# Altium schematic sheet boost.SchDoc
size A4
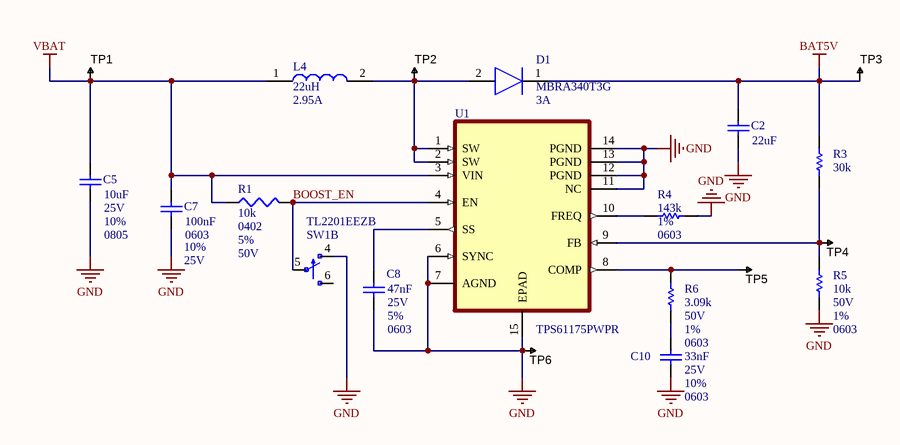
[diagram p0: boost.SchDoc]

## Parts
C2  value 22uF  [C0805]  (hidden comment: Cap Semi)
C5  value 10uF  Case/Package: 0805  Tolerance: 10%  Voltage Rating (DC): 25V  [C0805]  (hidden comment: Cap Semi)
C7  value 100nF  Case/Package: 0603  Tolerance: 10%  Voltage: 25V  [C0603]  (hidden comment: Cap Semi)
C8  value 47nF  Case/Package: 0603  Tolerance: 5%  Voltage Rating: 25V  [C0603]  (hidden comment: Cap Semi)
C10  value 33nF  Case/Package: 0603  Tolerance: 10%  Voltage Rating (DC): 25V  [C0603]  (hidden comment: Cap Semi)
D1  MBRA340T3G  Forward Current: 3A  [MBRA340T3G]
L4  value 22uH  Saturation Current: 2.95A  [CDRH105RNP-220NC]
R1  value 10k  Case/Package: 0402  Tolerance: 5%  Voltage Rating: 50V  [R0402]  (hidden comment: Res3)
R3  value 30k  [R0603]  (hidden comment: Res3)
R4  value 143k  Case/Package: 0603  Tolerance: 1%  [R0603]  (hidden comment: Res3)
R5  value 10k  Case/Package: 0603  Tolerance: 1%  Voltage Rating: 50V  [R0603]  (hidden comment: Res3)
R6  value 3.09k  Case/Package: 0603  Tolerance: 1%  Voltage Rating (DC): 50V  [R0603]  (hidden comment: Res3)
SW1  TL2201EEZB  [TL2201EEZB]  (part B of 2)
TP1  TESTPOINT  [TP-R60]  (value not drawn)  (no BOM)
TP2  TESTPOINT  [TP-R60]  (value not drawn)  (no BOM)
TP3  TESTPOINT  [TP-R60]  (value not drawn)  (no BOM)
TP4  TESTPOINT  [TP-R60]  (value not drawn)  (no BOM)
TP5  TESTPOINT  [TP-R60]  (value not drawn)  (no BOM)
TP6  TESTPOINT  [TP-R60]  (value not drawn)  (no BOM)
U1  TPS61175PWPR  [TPS61175PWPR]

## Nets
BAT5V: C2.2 D1.1(K) R3.1 TP3.1
GND: C2.1 C5.1 C7.1 C8.1 C10.1 R4.1 R5.2 SW1.4(O) TP6.1 U1.6(SYNC) U1.7(AGND) U1.11(NC) U1.12(PGND) U1.13(PGND) U1.14(PGND) U1.15(EPAD)
VBAT: C5.2 C7.2 L4.1 R1.1 TP1.1 U1.3(VIN)
BOOST_EN: R1.2 SW1.5(P) U1.4(EN)
NetC8_2: C8.2 U1.5(SS)
NetC10_2: C10.2 R6.2
NetD1_2: D1.2(A) L4.2 TP2.1 U1.1(SW) U1.2(SW)
NetR3_2: R3.2 R5.1 TP4.1 U1.9(FB)
NetR4_2: R4.2 U1.10(FREQ)
NetR6_1: R6.1 TP5.1 U1.8(COMP)

Not connected (* = marked no-connect by the designer): SW1 6(S)

## Library data of the parts
C2 = Cap Semi_1: Capacitor
C5 = Cap Semi_1: Capacitor; Manufacturer: Murata; Manufacturer Part Number: GRM21BR61E106KA73K; Dielectric: X5R; Supplier 1: Digi-Key; Supplier Part Number 1: 490-16824-1-ND; Stock 1: 55460; Pricing 1: 1=0.25, 10=0.172, 50=0.1034, 100=0.0874, 500=0.0598, 1000=0.0529, 2500=0.0506, 5000=0.046 (USD); Mount: Surface Mount; Weight: 0.000335oz; Min Operating Temperature: -55°C; Max Operating Temperature: 85°C; Packaging: Tape and Reel; Voltage Rating: 25V; Package Quantity: 10000; Length: 0.079inch; Width: 0.049inch; Thickness: 0.055inch; ComponentLink1URL: http://www.mouser.com/ds/2/281/c02e-2905.pdf?src-supplier=Mouser; ComponentLink1Description: http://www.mouser.com/ds/2/281/c02e-2905.pdf?src-supplier=Mouser; ComponentLink2URL: http://search.murata.co.jp/Ceramy/image/img/A01X/G101/ENG/GRM21BR61E106KA73-01.pdf?src-supplier=Digi-Key; ComponentLink2Description: http://search.murata.co.jp/Ceramy/image/img/A01X/G101/ENG/GRM21BR61E106KA73-01.pdf?src-supplier=Digi-Key; ComponentLink3URL: https://search.murata.co.jp/Ceramy/image/img/A01X/G101/ENG/GRM21BR61E106KA73-01.pdf?src-supplier=Digi-Key; ComponentLink3Description: https://search.murata.co.jp/Ceramy/image/img/A01X/G101/ENG/GRM21BR61E106KA73-01.pdf?src-supplier=Digi-Key
C7 = Cap Semi_1: Capacitor; Manufacturer: Yageo; Manufacturer Part Number: CC0603KRX7R8BB104; Dielectric: X7R; Supplier 1: Digi-Key; Supplier Part Number 1: 311-1341-1-ND; Stock 1: 11551656; Pricing 1: 1=0.1, 10=0.05, 50=0.0274, 100=0.0224, 500=0.016, 1000=0.0126 (USD); Mount: Surface Mount; Number of Pins: 2; Case Code (Imperial): 0603; Case Code (Metric): 1608; Min Operating Temperature: -55°C; Max Operating Temperature: 125°C; Voltage Rating: 25V; Packaging: Tape and Reel; Package Quantity: 1; Voltage Rating (DC): 25V; Termination: SMD/SMT; Composition: Ceramic; Length: 1.6mm; Height: 0.8mm; Width: 0.8mm; Thickness: 0.035inch; Depth: 0.8mm; Radiation Hardening: No; REACH SVHC: Unknown; Lead Free: Lead Free; Halogen Free: Halogen Free; ComponentLink1URL: http://www.yageo.com/documents/recent/UPY-GPHC_X7R_6.3V-to-50V_8.pdf?src-supplier=Avnet+Europe; ComponentLink1Description: http://www.yageo.com/documents/recent/UPY-GPHC_X7R_6.3V-to-50V_8.pdf?src-supplier=Avnet+Europe; ComponentLink2URL: https://www.verical.com/server-webapp/html/getDatasheet?partID=403577&src-supplier=Verical; ComponentLink2Description: https://www.verical.com/server-webapp/html/getDatasheet?partID=403577&src-supplier=Verical; ComponentLink3URL: http://www.yageo.com/documents/recent/UPY-GPHC_X7R_6.3V-to-50V_8.pdf?src-supplier=Avnet; ComponentLink3Description: http://www.yageo.com/documents/recent/UPY-GPHC_X7R_6.3V-to-50V_8.pdf?src-supplier=Avnet; ComponentLink4URL: http://www.mouser.com/ds/2/447/Yageo_UPY-GP_NP0_16V-to-50V_9-358835.pdf?src-supplier=Mouser; ComponentLink4Description: http://www.mouser.com/ds/2/447/Yageo_UPY-GP_NP0_16V-to-50V_9-358835.pdf?src-supplier=Mouser; ComponentLink5URL: https://4donline.ihs.com/images/VipMasterIC/IC/YAGO/YAGO-S-A0003557223/YAGO-S-A0003557223-1.pdf?hkey=6D3A4C79FDBF58556ACFDE234799DDF0&src-supplier=Element14; ComponentLink5Description: https://4donline.ihs.com/images/VipMasterIC/IC/YAGO/YAGO-S-A0003557223/YAGO-S-A0003557223-1.pdf?hkey=6D3A4C79FDBF58556ACFDE234799DDF0&src-supplier=Element14; ComponentLink6URL: http://www.yageo.com/documents/recent/UPY-GPHC_X7R_6.3V-to-50V_18.pdf?src-supplier=Digi-Key; ComponentLink6Description: http://www.yageo.com/documents/recent/UPY-GPHC_X7R_6.3V-to-50V_18.pdf?src-supplier=Digi-Key; ComponentLink7URL: http://www.farnell.com/datasheets/1489800.pdf?src-supplier=Element14; ComponentLink7Description: http://www.farnell.com/datasheets/1489800.pdf?src-supplier=Element14
C8 = Cap Semi_1: Capacitor; Manufacturer: KEMET; Manufacturer Part Number: C0603C473J3RACTU; Dielectric Material: Ceramic; Dielectric: X7R; Dissipation Factor: 3.5%; Supplier 1: Digi-Key; Supplier Part Number 1: 399-7929-1-ND; Stock 1: 73434; Pricing 1: 1=0.14, 10=0.098, 50=0.056, 100=0.0463, 500=0.0325, 1000=0.0269 (USD); Mount: Surface Mount; Case Code (Imperial): 0603; Case Code (Metric): 1608; Min Operating Temperature: -55°C; Max Operating Temperature: 125°C; Package Quantity: 1; Packaging: Tape and Reel; Voltage Rating (DC): 25V; Termination: SMD/SMT; Length: 1.6mm; Height: 0.8mm; Width: 0.8mm; Lead Pitch: 0.7mm; Thickness: 0.034inch; Depth: 0.8mm; Radiation Hardening: No; REACH SVHC: No SVHC; ComponentLink1URL: http://www.mouser.com/ds/2/212/KEM_C1002_X7R_SMD-1102033.pdf?src-supplier=Mouser; ComponentLink1Description: http://www.mouser.com/ds/2/212/KEM_C1002_X7R_SMD-1102033.pdf?src-supplier=Mouser; ComponentLink2URL: http://capacitoredge.kemet.com/capedge2/DataSheet?pn=C0603C473J3RAC7867&src-supplier=Avnet; ComponentLink2Description: http://capacitoredge.kemet.com/capedge2/DataSheet?pn=C0603C473J3RAC7867&src-supplier=Avnet; ComponentLink3URL: http://www.farnell.com/datasheets/2745905.pdf?src-supplier=Newark; ComponentLink3Description: http://www.farnell.com/datasheets/2745905.pdf?src-supplier=Newark; ComponentLink4URL: https://api.kemet.com/component-edge/download/datasheet/C0603C473J3RACTU.pdf?src-supplier=Digi-Key; ComponentLink4Description: https://api.kemet.com/component-edge/download/datasheet/C0603C473J3RACTU.pdf?src-supplier=Digi-Key; ComponentLink5URL: http://www.farnell.com/datasheets/2745905.pdf?src-supplier=Farnell; ComponentLink5Description: http://www.farnell.com/datasheets/2745905.pdf?src-supplier=Farnell; ComponentLink6URL: http://www.farnell.com/datasheets/2112169.pdf?src-supplier=Element14; ComponentLink6Description: http://www.farnell.com/datasheets/2112169.pdf?src-supplier=Element14; ComponentLink7URL: https://search.kemet.com/component-edge/download/datasheet/C0603C473J3RACTU.pdf?src-supplier=Digi-Key; ComponentLink7Description: https://search.kemet.com/component-edge/download/datasheet/C0603C473J3RACTU.pdf?src-supplier=Digi-Key; ComponentLink8URL: http://components.arrow.com/part/dataview/2627846S4295859N7429?src-supplier=Arrow+Electronics; ComponentLink8Description: http://components.arrow.com/part/dataview/2627846S4295859N7429?src-supplier=Arrow+Electronics
C10 = Cap Semi_1: Capacitor; Manufacturer: KEMET; Manufacturer Part Number: C0603C333K3RACTU; Dielectric Material: Ceramic; Dielectric: X7R; Dissipation Factor: 3.5%; Supplier 1: Digi-Key; Supplier Part Number 1: 399-7904-1-ND; Stock 1: 315627; Pricing 1: 1=0.1, 10=0.067, 50=0.0364, 100=0.0296, 500=0.0212, 1000=0.0166 (USD); Mount: Surface Mount; Case Code (Metric): 1608; Case Code (Imperial): 0603; Min Operating Temperature: -55°C; Max Operating Temperature: 125°C; Package Quantity: 1; Voltage Rating: 25V; Packaging: Tape and Reel; Termination: SMD/SMT; Length: 1.6mm; Height: 0.8mm; Width: 0.031inch; Thickness: 0.034inch; Lead Pitch: 0.7mm; Depth: 0.8mm; Radiation Hardening: No; REACH SVHC: No SVHC; ComponentLink1URL: http://www.mouser.com/ds/2/212/KEM_C1002_X7R_SMD-1102033.pdf?src-supplier=Mouser; ComponentLink1Description: http://www.mouser.com/ds/2/212/KEM_C1002_X7R_SMD-1102033.pdf?src-supplier=Mouser; ComponentLink2URL: https://www.verical.com/server-webapp/html/getDatasheet?partID=72507&src-supplier=Verical; ComponentLink2Description: https://www.verical.com/server-webapp/html/getDatasheet?partID=72507&src-supplier=Verical; ComponentLink3URL: http://www.farnell.com/datasheets/2740666.pdf?src-supplier=Element14; ComponentLink3Description: http://www.farnell.com/datasheets/2740666.pdf?src-supplier=Element14; ComponentLink4URL: http://www.farnell.com/datasheets/1851736.pdf?src-supplier=Element14; ComponentLink4Description: http://www.farnell.com/datasheets/1851736.pdf?src-supplier=Element14; ComponentLink5URL: https://www.verical.com/server-webapp/html/getDatasheet?partID=385538&src-supplier=Verical; ComponentLink5Description: https://www.verical.com/server-webapp/html/getDatasheet?partID=385538&src-supplier=Verical
D1 = MBRA340T3G: Diode; Manufacturer_Name: ON Semiconductor; Forward Voltage: 450mV; Peak Reverse Current: 300uA; Max Repetitive Reverse Voltage (Vrrm): 40V; Max Forward Surge Current (Ifsm): 100A; Element Configuration: Single; Polarity: Standard; Datasheet Link: http://www.onsemi.com/pub/Collateral/MBRA340T3-D.PDF; Height: 2.2mm; Manufacturer_Part_Number: MBRA340T3G; Arrow Part Number: MBRA340T3G; Arrow Price/Stock: https://www.arrow.com/en/products/mbra340t3g/on-semiconductor; Mouser Part Number: 863-MBRA340T3G; Mouser Price/Stock: https://www.mouser.co.uk/ProductDetail/ON-Semiconductor/MBRA340T3G?qs=3JMERSakebq0pjb145uRLw%3D%3D; Supplier 1: Digi-Key; Supplier Part Number 1: MBRA340T3GOSCT-ND; Manufacturer: ON Semiconductor; Manufacturer Part Number: MBRA340T3G; Stock 1: 94537; Pricing 1: 1=0.46, 10=0.344, 100=0.24, 500=0.152, 1000=0.1184 (USD); Case/Package: SMA; Number of Pins: 2; Min Operating Temperature: -55°C; Max Operating Temperature: 150°C; Package Quantity: 1; Packaging: Tape and Reel; Average Rectified Current: 3A; Peak Non-Repetitive Surge Current: 100A; Max Reverse Voltage (DC): 40V; Voltage Rating (DC): 40V; Current Rating: 3A; Output Current: 3A; Length: 4.32mm; Width: 2.6mm; Radiation Hardening: No; Lead Free: Lead Free; Halogen Free: Halogen Free; REACH SVHC: No SVHC; ComponentLink1URL: http://www.farnell.com/datasheets/1750836.pdf?src-supplier=Farnell; ComponentLink1Description: http://www.farnell.com/datasheets/1750836.pdf?src-supplier=Farnell; ComponentLink2URL: http://www.onsemi.cn/pub_link/Collateral/MBRA340T3-D.PDF?src-supplier=Avnet; ComponentLink2Description: http://www.onsemi.cn/pub_link/Collateral/MBRA340T3-D.PDF?src-supplier=Avnet; ComponentLink3URL: http://www.onsemi.com/pub/Collateral/MBRA340T3-D.PDF?src-supplier=Digi-Key; ComponentLink3Description: http://www.onsemi.com/pub/Collateral/MBRA340T3-D.PDF?src-supplier=Digi-Key; ComponentLink4URL: http://www.farnell.com/datasheets/1750836.pdf?src-supplier=Element14; ComponentLink4Description: http://www.farnell.com/datasheets/1750836.pdf?src-supplier=Element14; ComponentLink5URL: https://www.alliedelec.com/m/d/ea03cb33894de4ce312ef3cdec18c26f.pdf?src-supplier=Allied+Electronics; ComponentLink5Description: https://www.alliedelec.com/m/d/ea03cb33894de4ce312ef3cdec18c26f.pdf?src-supplier=Allied+Electronics; ComponentLink6URL: http://www.onsemi.com/pub/Collateral/MBRA340T3-D.PDF?src-supplier=Future+Electronics; ComponentLink6Description: http://www.onsemi.com/pub/Collateral/MBRA340T3-D.PDF?src-supplier=Future+Electronics
L4 = CDRH105RNP-220NC: FIXED IND 22UH 2.9A 61 MOHM SMD; Manufacturer: Sumida; Core Material: Ferrite; Tolerance: 30%; Shielding: Shielded; DC Resistance (DCR): 61mR; Test Frequency: 100kHz; Supplier 1: Digi-Key; Supplier Part Number 1: 308-2173-1-ND; Manufacturer Part Number: CDRH105RNP-220NC; Stock 1: 2383; Pricing 1: 1=1.45, 10=1.344, 25=1.2404, 50=1.0336, 100=0.9715, 250=0.8682 (USD); Mount: Surface Mount; Case/Package: Nonstandard; Weight: 0.063493oz; Min Operating Temperature: -40°C; Max Operating Temperature: 100°C; Packaging: Tape and Reel; Current Rating: 2.9A; Max DC Current: 2.9A; Termination: SMD/SMT; Length: 0.402inch; Height: 5.1mm; Width: 0.394inch; Height - Seated (Max): 0.201inch; Depth: 10.3mm; Radiation Hardening: No; Lead Free: Lead Free; ComponentLink1URL: http://products.sumida.com/products/pdf/CDRH105R.pdf?src-supplier=Digi-Key; ComponentLink1Description: http://products.sumida.com/products/pdf/CDRH105R.pdf?src-supplier=Digi-Key; ComponentLink2URL: http://www.sumida.com/products/pdf/CDRH105R.pdf?src-supplier=Avnet; ComponentLink2Description: http://www.sumida.com/products/pdf/CDRH105R.pdf?src-supplier=Avnet; ComponentLink3URL: http://www.mouser.com/ds/2/390/CDRH105R-465909.pdf?src-supplier=Mouser; ComponentLink3Description: http://www.mouser.com/ds/2/390/CDRH105R-465909.pdf?src-supplier=Mouser
R1 = Res3: Resistor; Manufacturer: TE Connectivity; Manufacturer Part Number: CRG0402J10K/10; Resistance: 10kR; Temperature Coefficient: 200ppm/°C; Power Rating: 63mW; Number of Resistors: 1; Supplier 1: Digi-Key; Supplier Part Number 1: 311-10KJRCT-ND; Supplier 2: Digi-Key; Supplier Part Number 2: A106045CT-ND; Stock 2: 164304; Pricing 2: 1=0.1, 10=0.016, 100=0.0064, 1000=0.0029, 2500=0.0025, 5000=0.0021 (USD); Mount: Surface Mount; Weight: 2.3E-05oz; Case Code (Imperial): 0402; Case Code (Metric): 1005; Min Operating Temperature: -55°C; Max Operating Temperature: 125°C; Packaging: Tape and Reel; Composition: Thick Film; Package Quantity: 10000; Number of Terminations: 2; Termination: Solder; Voltage Rating (DC): 50V; Length: 1mm; Height: 0.35mm; Width: 0.5mm; Depth: 0.5mm; Radiation Hardening: No; REACH SVHC: Unknown; ELV: Compliant; ComponentLink1URL: http://uk.rs-online.com/webdocs/13e2/0900766b813e23cb.pdf; ComponentLink1Description: http://uk.rs-online.com/webdocs/13e2/0900766b813e23cb.pdf; ComponentLink2URL: http://www.farnell.com/datasheets/1610603.pdf; ComponentLink2Description: http://www.farnell.com/datasheets/1610603.pdf; ComponentLink3URL: http://www.mouser.com/ds/2/418/NG_CD_1622826_BA1-677535.pdf; ComponentLink3Description: http://www.mouser.com/ds/2/418/NG_CD_1622826_BA1-677535.pdf; ComponentLink4URL: http://www.te.com/commerce/DocumentDelivery/DDEController?Action=showdoc&DocId=Data+Sheet%7F1773204%7FF%7Fpdf%7FEnglish%7FENG_DS_1773204_F.pdf; ComponentLink4Description: http://www.te.com/commerce/DocumentDelivery/DDEController?Action=showdoc&DocId=Data+Sheet%7F1773204%7FF%7Fpdf%7FEnglish%7FENG_DS_1773204_F.pdf
R3 = Res1_2: Resistor
R4 = Res1_2: Resistor; Manufacturer: Stackpole Electronics; Manufacturer Part Number: RMCF0603FT143K; Max Power Dissipation: 100mW; Temperature Coefficient: 100ppm/°C; Supplier 1: Digi-Key; Supplier Part Number 1: RMCF0603FT143KCT-ND; Stock 1: 44411; Pricing 1: 1=0.1, 10=0.015, 100=0.0063, 1000=0.0028, 2500=0.0024 (USD); Mount: Surface Mount; Case Code (Metric): 1608; Case Code (Imperial): 0603; Contact Plating: Tin,Matte; Min Operating Temperature: -55°C; Max Operating Temperature: 155°C; Packaging: Tape and Reel; Composition: Thick Film; Number of Terminations: 2; Features: Automotive AEC-Q200; Length: 0.061inch; Height: 0.022inch; Width: 0.031inch; Radiation Hardening: No; Lead Free: Lead Free; ComponentLink1URL: https://www.seielect.com/catalog/SEI-Packaging.pdf?src-supplier=Digi-Key; ComponentLink1Description: https://www.seielect.com/catalog/SEI-Packaging.pdf?src-supplier=Digi-Key; ComponentLink2URL: https://www.seielect.com/catalog/SEI-RMCF_RMCP.pdf?src-supplier=Avnet; ComponentLink2Description: https://www.seielect.com/catalog/SEI-RMCF_RMCP.pdf?src-supplier=Avnet; ComponentLink3URL: https://www.seielect.com/Catalog/SEI-RMCF_RMCP.pdf?src-supplier=Digi-Key; ComponentLink3Description: https://www.seielect.com/Catalog/SEI-RMCF_RMCP.pdf?src-supplier=Digi-Key
R5 = Res1_2: Resistor; Manufacturer: TE Connectivity Neohm; Manufacturer Part Number: CPF0603F10KC1; Temperature Coefficient: 50ppm/°C; Power Rating: 63mW; Number of Resistors: 1; Supplier 1: Digi-Key; Supplier Part Number 1: A102203CT-ND; Stock 1: 38553; Pricing 1: 1=0.18, 10=0.153, 100=0.0597 (USD); Mount: Surface Mount; Number of Pins: 2; Case Code (Metric): 1608; Case Code (Imperial): 0603; Min Operating Temperature: -55°C; Max Operating Temperature: 155°C; Composition: Thin Film; Packaging: Tape and Reel; Number of Terminations: 2; Termination: Solder; Voltage Rating (DC): 50V; Width: 0.8mm; Radiation Hardening: No; REACH SVHC: Unknown; ELV: Compliant; ComponentLink1URL: http://www.farnell.com/datasheets/1786775.pdf?src-supplier=Onlinecomponents.com; ComponentLink1Description: http://www.farnell.com/datasheets/1786775.pdf?src-supplier=Onlinecomponents.com; ComponentLink2URL: http://www.farnell.com/datasheets/1786775.pdf?src-supplier=Element14; ComponentLink2Description: http://www.farnell.com/datasheets/1786775.pdf?src-supplier=Element14
R6 = Res1_2: Resistor; Manufacturer: Yageo; Manufacturer Part Number: RC0603FR-073K09L; Power Rating: 100mW; Temperature Coefficient: 100ppm/°C; Supplier 1: Digi-Key; Supplier Part Number 1: 311-3.09KHRCT-ND; Stock 1: 238098; Pricing 1: 1=0.1, 10=0.022, 100=0.009, 1000=0.0041, 2500=0.0035 (USD); Mount: Surface Mount; Case Code (Imperial): 0603; Case Code (Metric): 1608; Min Operating Temperature: -55°C; Max Operating Temperature: 155°C; Voltage Rating: 50V; Packaging: Tape and Reel; Termination: SMD/SMT; Military Standard: Not; Composition: Thick Film; Length: 1.6mm; Height: 0.45mm; Depth: 0.8mm; Lead Free: Lead Free; ComponentLink1URL: https://www.verical.com/server-webapp/html/getDatasheet?partID=327924&src-supplier=Verical; ComponentLink1Description: https://www.verical.com/server-webapp/html/getDatasheet?partID=327924&src-supplier=Verical; ComponentLink2URL: http://documents.rs-components.com/techlib://itc_doclist_GB.htm?stockno=6167446&src-supplier=RSComponents; ComponentLink2Description: http://documents.rs-components.com/techlib://itc_doclist_GB.htm?stockno=6167446&src-supplier=RSComponents
SW1 = TL2201EEZB: Pushbutton Switch DPDT Standard Through Hole; MF: E-Switch; Purchase-URL: https://pricing.snapeda.com/search/part/TL2201EEZB/?ref=eda; MP: TL2201EEZB; Value: *; Availability: Good; Check_prices: https://www.snapeda.com/parts/TL2201EEZB/E-Switch/view-part/5162943/?ref=eda; SnapEDA_Link: https://www.snapeda.com/parts/TL2201EEZB/E-Switch/view-part/5162943/?ref=snap; Price: None; Package: None
TP1-TP6 = TESTPOINT: SMD test pin
U1 = TPS61175PWPR: IC REG MULTI CONFG ADJ 14HTSSOP; Manufacturer: Texas Instruments; Efficiency: 93%; Min Input Voltage: 2.9V; Output Voltage: 38V; Number of Outputs: 1; Max Output Current: 3A; Max Input Voltage: 18V; Switching Frequency: 2.2MHz; Synchronous Rectifier: Yes; Quiescent Current: 3mA; Topology: Boost,Flyback,SEPIC; Output Type: Adjustable; Output Configuration: Positive; Supplier 1: Digi-Key; Supplier Part Number 1: 296-24013-1-ND; Manufacturer Part Number: TPS61175PWPR; Stock 1: 11099; Pricing 1: 1=3.03, 10=2.723, 25=2.574, 100=2.1164, 250=1.899, 500=1.8304, 1000=1.5215 (USD); Mount: Surface Mount; Case/Package: HTSSOP EP; Number of Pins: 14; Weight: 0.002046oz; Contact Plating: Gold; Min Operating Temperature: -40°C; Max Operating Temperature: 85°C; Packaging: Tape and Reel; Output Current: 3A; Package Quantity: 1; Min Output Voltage: 2.9V; Max Output Voltage: 38V; Operating Supply Voltage: 18V; Radiation Hardening: No; REACH SVHC: No SVHC; Lead Free: Lead Free; ComponentLink1URL: http://www.ti.com/lit/ds/symlink/tps61175.pdf?src-supplier=Digi-Key; ComponentLink1Description: http://www.ti.com/lit/ds/symlink/tps61175.pdf?src-supplier=Digi-Key; ComponentLink2URL: http://www.ti.com/general/docs/lit/getliterature.tsp?genericPartNumber=TPS61175&&fileType=pdf&src-supplier=Avnet; ComponentLink2Description: http://www.ti.com/general/docs/lit/getliterature.tsp?genericPartNumber=TPS61175&&fileType=pdf&src-supplier=Avnet; ComponentLink3URL: http://www.ti.com/lit/ds/symlink/tps61175.pdf?src-supplier=Avnet+Europe; ComponentLink3Description: http://www.ti.com/lit/ds/symlink/tps61175.pdf?src-supplier=Avnet+Europe; ComponentLink4URL: http://datasheet.iiic.cc/texas_instruments/TPS61175PWPR.pdf?src-supplier=IIIC; ComponentLink4Description: http://datasheet.iiic.cc/texas_instruments/TPS61175PWPR.pdf?src-supplier=IIIC; ComponentLink5URL: http://www.produktinfo.conrad.com/datenblaetter/1000000-1099999/001014891-da-01-en-IC_REG_MULTI_C_TPS61175PWPR_TSSOP_14_TID.pdf?src-supplier=Conrad; ComponentLink5Description: http://www.produktinfo.conrad.com/datenblaetter/1000000-1099999/001014891-da-01-en-IC_REG_MULTI_C_TPS61175PWPR_TSSOP_14_TID.pdf?src-supplier=Conrad